# Altium schematic sheet MB1360_TOP.SchDoc: TOP
size A4; CompanyName: STMicroelectronics; Organization: Microcontrollers Division; SheetNumber: 2; SheetTotal: 8
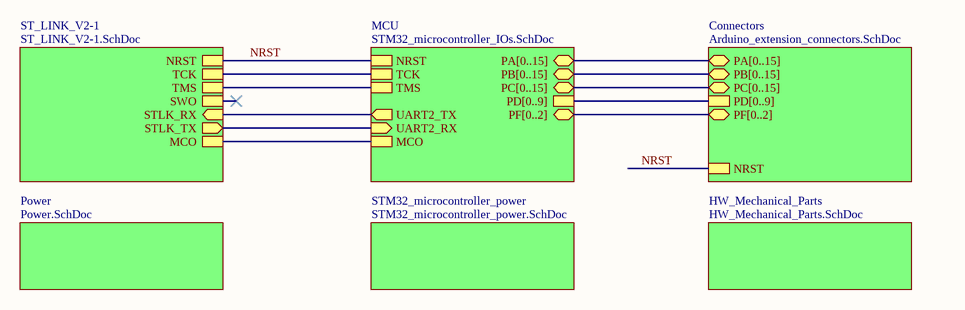
[diagram p0: MB1360_TOP.SchDoc]

## Sub-sheets
Connectors = Arduino_extension_connectors.SchDoc: PA[0..15] (bidir), PB[0..15] (bidir), PC[0..15] (bidir), NRST, PD[0..9], PF[0..2] (bidir)
HW_Mechanical_Parts = HW_Mechanical_Parts.SchDoc: no entries
MCU = STM32_microcontroller_IOs.SchDoc: NRST, MCO, UART2_RX (in), UART2_TX (out), PA[0..15] (bidir), PB[0..15] (bidir), PC[0..15] (bidir), TCK, TMS, PD[0..9], PF[0..2] (bidir)
Power = Power.SchDoc: no entries
ST_LINK_V2-1 = ST_LINK_V2-1.SchDoc: TMS, TCK, MCO, NRST, STLK_RX (in), STLK_TX (out), SWO
STM32_microcontroller_power = STM32_microcontroller_power.SchDoc: no entries

## Nets
NRST: sheet ST_LINK_V2-1/NRST, sheet Connectors/NRST, sheet MCU/NRST
(unnamed): sheet ST_LINK_V2-1/TMS, sheet MCU/TMS
(unnamed): sheet ST_LINK_V2-1/TCK, sheet MCU/TCK
(unnamed): sheet ST_LINK_V2-1/MCO, sheet MCU/MCO
(unnamed): sheet ST_LINK_V2-1/STLK_RX, sheet MCU/UART2_TX
(unnamed): sheet ST_LINK_V2-1/STLK_TX, sheet MCU/UART2_RX

## Buses and harness runs
bus sheet Connectors/PA[0..15] = sheet MCU/PA[0..15]
bus sheet Connectors/PB[0..15] = sheet MCU/PB[0..15]
bus sheet Connectors/PC[0..15] = sheet MCU/PC[0..15]
bus sheet Connectors/PD[0..9] = sheet MCU/PD[0..9]
bus sheet Connectors/PF[0..2] = sheet MCU/PF[0..2]

## Notes on the sheet
- Title:
- Project:
- Size:
- Revision:
- Variant:
- A4
- -
- Date:
- Reference:
- Sheet:
- of